# Altium schematic sheet STM.SchDoc
size A4
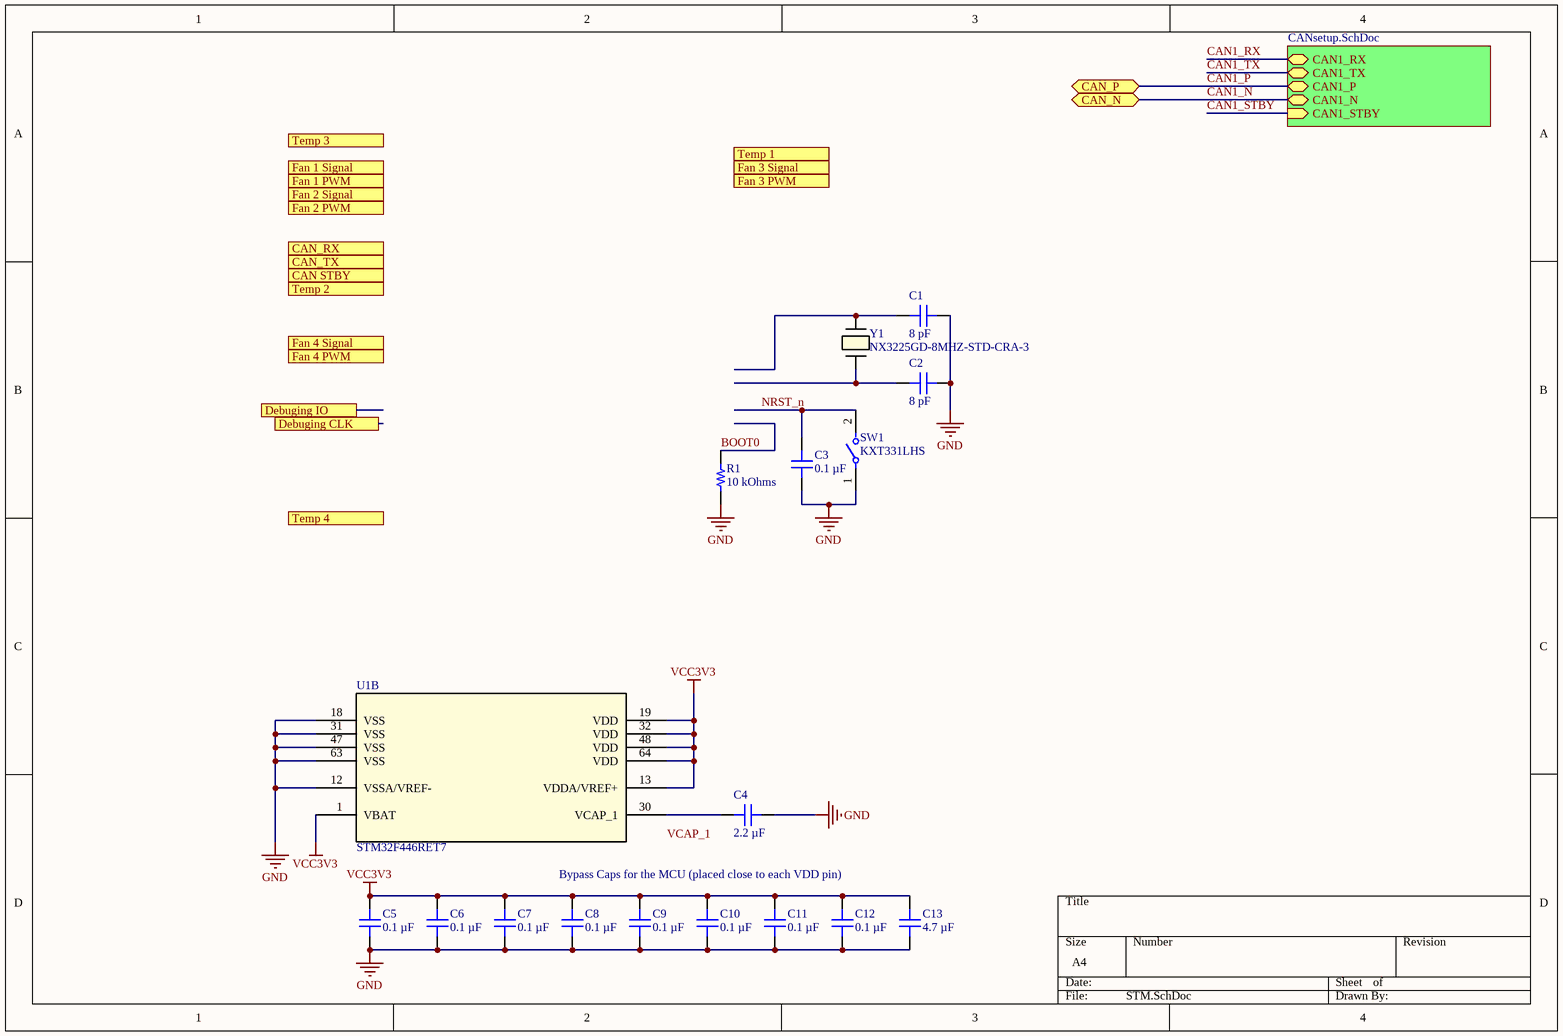
[diagram p0: STM.SchDoc]

## Parts
C1  8 pF  [CAP 0402_1005]
C2  8 pF  [CAP 0402_1005]
C3  0.1 µF  [CAP 01005_0402]
C4  2.2 µF  [CAP 0402_1005]
C5  0.1 µF  [CAP 01005_0402]
C6  0.1 µF  [CAP 01005_0402]
C7  0.1 µF  [CAP 01005_0402]
C8  0.1 µF  [CAP 01005_0402]
C9  0.1 µF  [CAP 01005_0402]
C10  0.1 µF  [CAP 01005_0402]
C11  0.1 µF  [CAP 01005_0402]
C12  0.1 µF  [CAP 01005_0402]
C13  4.7 µF  [CAP 0402_1005]
R1  10 kOhms  [RES 0201_0603]
SW1  KXT331LHS  [FP-KXT331LHS-MFG]
U1  STM32F446RET7  [LQFP64-10x10mm]  (part B of 2)
Y1  NX3225GD-8MHZ-STD-CRA-3  [XTAL_NX3225GD-8MHZ-STD-CRA-3_NDK]

## Sub-sheets
CAN = CANsetup.SchDoc: CAN1_RX (bidir), CAN1_TX (bidir), CAN1_STBY (in), CAN1_P (bidir), CAN1_N (bidir)

## Ports
CAN STBY, CAN_N (bidir), CAN_P (bidir), CAN_RX, CAN_TX, Debuging CLK, Debuging IO, Fan 1 PWM, Fan 1 Signal, Fan 2 PWM, Fan 2 Signal, Fan 3 PWM, Fan 3 Signal, Fan 4 PWM, Fan 4 Signal, Temp 1, Temp 2, Temp 3, Temp 4

## Nets
GND: C1.1 C2.1 C3.2 C4.1 C5.2 C6.2 C7.2 C8.2 C9.2 C10.2 C11.2 C12.2 C13.1 R1.1 SW1.1 U1.12(VSSA/VREF-) U1.18(VSS) U1.31(VSS) U1.47(VSS) U1.63(VSS)
VCC3V3: C5.1 C6.1 C7.1 C8.1 C9.1 C10.1 C11.1 C12.1 C13.2 U1.1(VBAT) U1.13(VDDA/VREF+) U1.19(VDD) U1.32(VDD) U1.48(VDD) U1.64(VDD)
BOOT0: R1.2
CAN1_N: port CAN_N, sheet CAN/CAN1_N
CAN1_P: port CAN_P, sheet CAN/CAN1_P
CAN1_RX: sheet CAN/CAN1_RX
CAN1_STBY: sheet CAN/CAN1_STBY
CAN1_TX: sheet CAN/CAN1_TX
NRST_n: C3.1 SW1.2
NetC1_2: C1.2 Y1.1
NetC2_2: C2.2 Y1.2
NetC4_2: C4.2 U1.30(VCAP_1)

## Notes on the sheet
- Bypass Caps for the MCU (placed close to each VDD pin)
- Labels drawn without touching a wire or pin: VCAP_1

## Library data of the parts
C1 C2 = GCM1555C1H8R0FA16D: CAP CER 8PF 50V C0G/NP0 0402; manufacturer: Murata Electronics; Temperature Coefficient: C0G, NP0; Tolerance: ±1%; Part Number: GCM1555C1H8R0FA16D; Value: 8 pF; Applications: Automotive; Capacitance: 8 pF; componentlink1description: Datasheet; componentlink1url: https://search.murata.co.jp/Ceramy/image/img/A01X/G101/ENG/GCM1555C1H8R0FA16-01.pdf; componentlink2description: DigiKey Link; componentlink2url: https://www.digikey.com/en/products/detail/murata-electronics/GCM1555C1H8R0FA16D/11618789; Device Package: 0402 (1005 Metric); lastupdated: 2024-01-11 8:04:05 PM; Lifecycle Status: Active; Minimum Order: 1; Mounting Type: Surface Mount, MLCC; Operating Temperature: -55°C ~ 125°C; Package / Case: 0402 (1005 Metric); packaging: TapeAndReel; partid: 34002; Part Status: Active; price: 0.01; Ratings: AEC-Q200; series: GCM; Size / Dimension: 0.039" L x 0.020" W (1.00mm x 0.50mm); Supplier 1: DigiKey; Supplier Part Number 1: 490-GCM1555C1H8R0FA16DCT-ND; Thickness (Max): 0.022" (0.55mm); Voltage - Rated: 50V
C3 C5-C12 = CL02A104KQ2NNNC: CAP CER 0.1UF 6.3V X5R 01005; manufacturer: Samsung Electro-Mechanics; Tolerance: ±10%; Part Number: CL02A104KQ2NNNC; Value: 0.1 µF; Applications: General Purpose; Capacitance: 0.1 µF; componentlink1description: Datasheet; componentlink1url: http://www.samsungsem.com/kr/support/product-search/mlcc/CL02A104KQ2NNNC.jsp; componentlink2description: DigiKey Link; componentlink2url: https://www.digikey.com/en/products/detail/samsung-electro-mechanics/CL02A104KQ2NNNC/3886867; Device Package: 01005 (0402 Metric); lastupdated: 2023-11-30 9:46:05 PM; Lifecycle Status: Active; Minimum Order: 1; Mounting Type: Surface Mount, MLCC; Operating Temperature: -55°C ~ 85°C; Package / Case: 01005 (0402 Metric); packaging: TapeAndReel; Part Status: Active; price: 0.02; series: CL; Size / Dimension: 0.016" L x 0.008" W (0.40mm x 0.20mm); Supplier 1: DigiKey; Supplier Part Number 1: 1276-1209-1-ND; Temperature Coefficient: X5R; Thickness (Max): 0.009" (0.22mm); Voltage - Rated: 6.3V
C4 = CL05A225KO5NQNC: CAP CER 2.2UF 16V X5R 0402; manufacturer: Samsung Electro-Mechanics; Tolerance: ±10%; Part Number: CL05A225KO5NQNC; Value: 2.2 µF; Applications: General Purpose; Capacitance: 2.2 µF; componentlink1description: Datasheet; componentlink1url: http://www.samsungsem.com/kr/support/product-search/mlcc/CL05A225KO5NQNC.jsp; componentlink2description: DigiKey Link; componentlink2url: https://www.digikey.com/en/products/detail/samsung-electro-mechanics/CL05A225KO5NQNC/3887119; Device Package: 0402 (1005 Metric); lastupdated: 2024-01-11 8:04:27 PM; Lifecycle Status: Active; Minimum Order: 1; Mounting Type: Surface Mount, MLCC; Operating Temperature: -55°C ~ 85°C; Package / Case: 0402 (1005 Metric); packaging: TapeAndReel; partid: 1761; Part Status: Active; price: 0.03; series: CL; Size / Dimension: 0.039" L x 0.020" W (1.00mm x 0.50mm); Supplier 1: DigiKey; Supplier Part Number 1: 1276-1461-1-ND; Temperature Coefficient: X5R; Thickness (Max): 0.022" (0.55mm); Voltage - Rated: 16V
C13 = CL05A475MO5NUNC: CAP CER 4.7UF 16V X5R 0402; manufacturer: Samsung Electro-Mechanics; Tolerance: ±20%; Part Number: CL05A475MO5NUNC; Value: 4.7 µF; Applications: General Purpose; Capacitance: 4.7 µF; componentlink1description: Datasheet; componentlink1url: http://www.samsungsem.com/kr/support/product-search/mlcc/__icsFiles/afieldfile/2019/05/29/Data%20sheet_CL05A475MO5NUNC.pdf; componentlink2description: DigiKey Link; componentlink2url: https://www.digikey.com/en/products/detail/samsung-electro-mechanics/CL05A475MO5NUNC/5961320; Device Package: 0402 (1005 Metric); lastupdated: 2024-01-11 8:04:27 PM; Lifecycle Status: Active; Minimum Order: 1; Mounting Type: Surface Mount, MLCC; Operating Temperature: -55°C ~ 85°C; Package / Case: 0402 (1005 Metric); packaging: TapeAndReel; partid: 1760; Part Status: Active; price: 0.08; series: CL; Size / Dimension: 0.039" L x 0.020" W (1.00mm x 0.50mm); Supplier 1: DigiKey; Supplier Part Number 1: 1276-6836-1-ND; Temperature Coefficient: X5R; Thickness (Max): 0.028" (0.70mm); Voltage - Rated: 16V
R1 = CRCW020110K0FKED: RES SMD 10K OHM 1% 1/20W 0201; Manufacturer: Vishay Dale; Power (Watts): 0.05W, 1/20W; Temperature Coefficient: ±100ppm/°C; Part Number: CRCW020110K0FKED; Value: 10 kOhms; ComponentLink1Description: Datasheet; ComponentLink1URL: http://www.vishay.com/docs/20052/crcw0201e3.pdf; ComponentLink2Description: DigiKey Link; ComponentLink2URL: https://www.digikey.com/en/products/detail/vishay-dale/CRCW020110K0FKED/1967989; Composition: Thick Film; Device Package: 0201 (0603 Metric); Height - Seated (Max): 0.010" (0.26mm); LastUpdated: 2024-01-11 8:21:19 PM; Lifecycle Status: Active; Minimum Order: 1; Number of Terminations: 2; Operating Temperature: -55°C ~ 155°C; Package / Case: 0201 (0603 Metric); Packaging: TapeAndReel; PartId: 29; Part Status: Active; Price: 0.02; Resistance: 10 kOhms; Series: CRCW; Size / Dimension: 0.024" L x 0.012" W (0.60mm x 0.30mm); Supplier 1: DigiKey; Supplier Part Number 1: 541-10.0KAABCT-ND; Supplier Device Package: 0201; Tolerance: ±1%
SW1 = CMP-10040-000029-1: SWITCH TACTILE SPST-NO 0.02A 15V; Operating Force: 240gf; Switch Travel: 0.13mm; Illumination Type: Non-Illuminated; Throw Configuration: SPST; Number of Ports: 1; Current Rating: 5A; Mechanical Life: 500000Cycles; Switch Function: Off-Mom; Connector Type: USB; Actuator Type: Standard; Gender: Receptacle; Number of Contacts: 24; Contact Plating: Gold; Insulation Color: Black; Min Operating Temperature: -40°C; Packaging: Tape and Reel; Flammability Rating: UL94 V-0; Max Operating Temperature: 85°C; Termination: Solder; Mount: Surface Mount
U1 = STM32F446RET7: No Description Available; Mfr_Name: STMicroelectronics; Copyright: Copyright (C) 2024 Ultra Librarian. All rights reserved.; Manufacturer_Part_Number: STM32F446RET7; RefDes: RefDes; Type: DEV
Y1 = NX3225GD-8MHZ-STD-CRA-3: No Description Available; Mfr_Name: NDK; Copyright: Copyright (C) 2024 Ultra Librarian. All rights reserved.; Manufacturer_Part_Number: NX3225GD-8MHZ-STD-CRA-3; RefDes: RefDes; Type: DEV